# Altium schematic sheet Sheet1.SchDoc
size A4; SheetNumber: 1; SheetTotal: 5
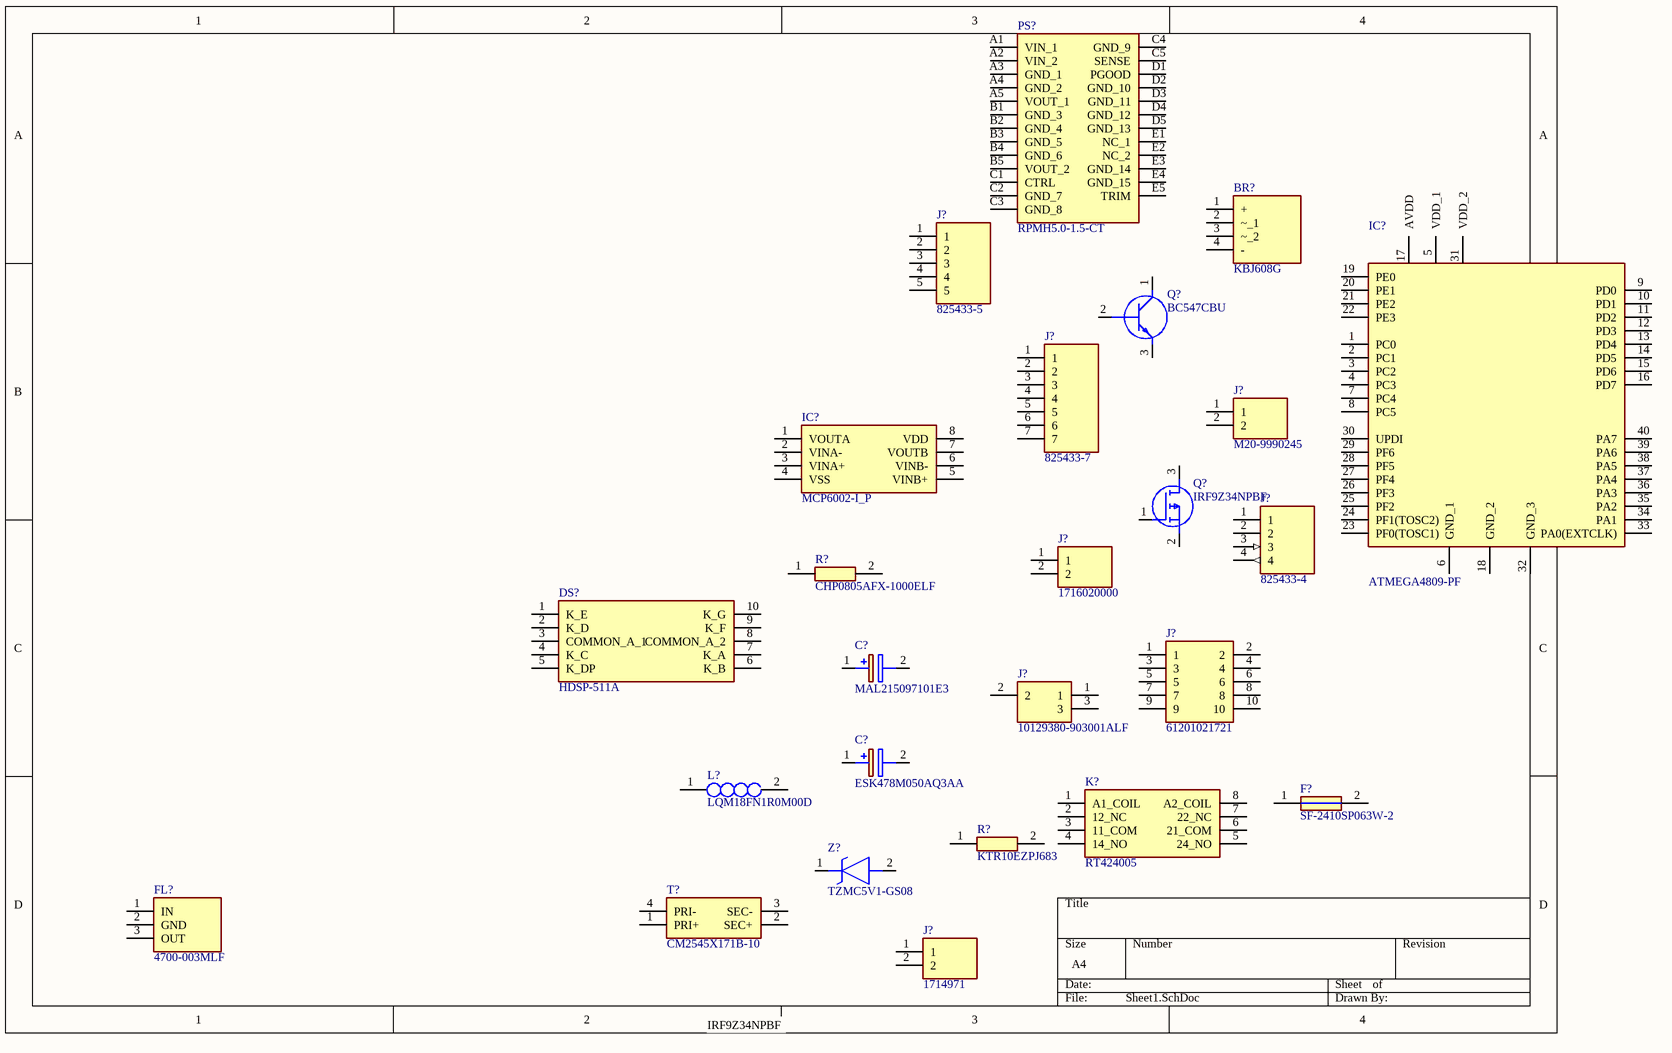
[diagram p0: Sheet1.SchDoc]

## Parts
(Parts that share a designator on the sheet are numbered #1, #2 ... from top to bottom, then left to right.)
BR?  KBJ608G  [TO750P480X2500X1900-4P]
C?#1  MAL215097101E3  [CAPAE1050X1050N]
C?#2  ESK478M050AQ3AA  [CAPPRD1000W80D2200H3700]
DS?  HDSP-511A  [HDSP511A]
F?  SF-2410SP063W-2  [FUSC6125X236N]
FL?  4700-003MLF  [4700003MLF]
IC?#1  ATMEGA4809-PF  [DIP1543W58P254L5175H635Q40N]
IC?#2  MCP6002-I_P  [DIP781W56P254L950H533Q8N]
J?#1  825433-5  [HDRV5W63P0X254_1X5_1270X254X970P]
J?#2  825433-7  [8254337]
J?#3  M20-9990245  [HDRV2W64P0X254_1X2_508X254X864P]
J?#4  825433-4  [HDRV4W63P0X254_1X4_1016X250X950P]
J?#5  1716020000  [1716020000]
J?#6  61201021721  [SHDRRA10W64P254X254_2X5_2036X885X910P]
J?#7  10129380-903001ALF  [10129380903001ALF]
J?#8  1714971  [1714971]
K?  RT424005  [RT42]
L?  LQM18FN1R0M00D  [LQM18FN100M00D]
PS?  RPMH5.0-1.5-CT  [RPMH5015]
Q?#1  BC547CBU  [BC547CBU]
Q?#2  IRF9Z34NPBF  [TO254P469X1042X1967-3P]
R?#1  CHP0805AFX-1000ELF  [RESC2012X60N]
R?#2  KTR10EZPJ683  [RESC2012X65N]
T?  CM2545X171B-10  [CM2545X171B10]
Z?  TZMC5V1-GS08  [TZMC5V1GS08]

## Nets

Not connected (* = marked no-connect by the designer): BR? 1(+) 2(~_1) 3(~_2) 4(-); C?#1 1(+) 2(-); C?#2 1(+) 2(-); DS? 1(K_E) 2(K_D) 3(COMMON_A_1) 4(K_C) 5(K_DP) 6(K_B) 7(K_A) 8(COMMON_A_2) 9(K_F) 10(K_G); F? 1 2; FL? 1(IN) 2(GND) 3(OUT); IC?#1 1(PC0) 2(PC1) 3(PC2) 4(PC3) 5(VDD_1) 6(GND_1) 7(PC4) 8(PC5) 9(PD0) 10(PD1) 11(PD2) 12(PD3) 13(PD4) 14(PD5) 15(PD6) 16(PD7) 17(AVDD) 18(GND_2) 19(PE0) 20(PE1) 21(PE2) 22(PE3) 23(PF0(TOSC1)) 24(PF1(TOSC2)) 25(PF2) 26(PF3) 27(PF4) 28(PF5) 29(PF6) 30(UPDI) 31(VDD_2) 32(GND_3) 33(PA0(EXTCLK)) 34(PA1) 35(PA2) 36(PA3) 37(PA4) 38(PA5) 39(PA6) 40(PA7); IC?#2 1(VOUTA) 2(VINA-) 3(VINA+) 4(VSS) 5(VINB+) 6(VINB-) 7(VOUTB) 8(VDD); J?#1 1 2 3 4 5; J?#2 1 2 3 4 5 6 7; J?#3 1 2; J?#4 1 2 3 4; J?#5 1 2; J?#6 1 2 3 4 5 6 7 8 9 10; J?#7 1 2 3; J?#8 1 2; K? 1(A1_COIL) 2(12_NC) 3(11_COM) 4(14_NO) 5(24_NO) 6(21_COM) 7(22_NC) 8(A2_COIL); L? 1 2; PS? A1(VIN_1) A2(VIN_2) A3(GND_1) A4(GND_2) A5(VOUT_1) B1(GND_3) B2(GND_4) B3(GND_5) B4(GND_6) B5(VOUT_2) C1(CTRL) C2(GND_7) C3(GND_8) C4(GND_9) C5(SENSE) D1(PGOOD) D2(GND_10) D3(GND_11) D4(GND_12) D5(GND_13) E1(NC_1) E2(NC_2) E3(GND_14) E4(GND_15) E5(TRIM); Q?#1 1(C) 2(B) 3(E); Q?#2 1(G) 2(S) 3(D); R?#1 1 2; R?#2 1 2; T? 1(PRI+) 2(SEC+) 3(SEC-) 4(PRI-); Z? 1(K) 2(A)

## Notes on the sheet
- IRF9Z34NPBF

## Library data of the parts
BR? = KBJ608G: Bridge Rectifier; Manufacturer_Name: Diodes Inc.; Datasheet Link: https://componentsearchengine.com//KBJ608G.pdf; Height: 4.8mm; Mouser2 Part Number: 621-KBJ608G; Mouser2 Price/Stock: https://www.mouser.com/Search/Refine.aspx?Keyword=621-KBJ608G; Manufacturer_Part_Number: KBJ608G
C?#1 = MAL215097101E3: Capacitor Polarised; Manufacturer_Name: Vishay; Datasheet Link: https://componentsearchengine.com/Datasheets/2/MAL215097101E3.pdf; Height: 10.5mm; Manufacturer_Part_Number: MAL215097101E3
C?#2 = ESK478M050AQ3AA: Capacitor Polarised; Manufacturer_Name: Kemet; Datasheet Link: https://componentsearchengine.com//ESK478M050AQ3AA.pdf; Height: 37mm; Mouser2 Part Number: 80-ESK478M050AQ3AA; Mouser2 Price/Stock: https://www.mouser.com/Search/Refine.aspx?Keyword=80-ESK478M050AQ3AA; Manufacturer_Part_Number: ESK478M050AQ3AA
DS? = HDSP-511A: Display; Manufacturer_Name: Avago Technologies; Datasheet Link: https://datasheet.datasheetarchive.com/originals/distributors/SFDatasheet-4/sf-00083626.pdf; Height: 8mm; Mouser2 Part Number: 630-HDSP-511A; Mouser2 Price/Stock: https://www.mouser.com/Search/Refine.aspx?Keyword=630-HDSP-511A; Manufacturer_Part_Number: HDSP-511A
F? = SF-2410SP063W-2: Fuse; Manufacturer_Name: Bourns; Datasheet Link: https://www.bourns.com/docs/Product-Datasheets/SF-2410SPxxxW.pdf; Height: 2.36mm; Manufacturer_Part_Number: SF-2410SP063W-2
FL? = 4700-003MLF: Filter; Manufacturer_Name: CTS; Datasheet Link: http://www.ctscorp.com/wp-content/uploads/2016/01/4700-003.pdf; Height: 2.41mm; Manufacturer_Part_Number: 4700-003MLF
IC?#1 = ATMEGA4809-PF: Integrated Circuit; Manufacturer_Name: Microchip; Datasheet Link: https://componentsearchengine.com//ATMEGA4809-PF.pdf; Height: 6.35mm; Mouser2 Part Number: 556-ATMEGA4809-PF; Mouser2 Price/Stock: https://www.mouser.com/Search/Refine.aspx?Keyword=556-ATMEGA4809-PF; Manufacturer_Part_Number: ATMEGA4809-PF
IC?#2 = MCP6002-I_P: Integrated Circuit; Manufacturer_Name: Microchip; Manufacturer_Part_Number: MCP6002-I/P; Datasheet Link: https://componentsearchengine.com//MCP6002-I_P.pdf; Height: 5.334mm; Mouser2 Part Number: 579-MCP6002-I/P; Mouser2 Price/Stock: https://www.mouser.com/Search/Refine.aspx?Keyword=579-MCP6002-I%2FP
J?#1 = 825433-5: Connector; Manufacturer_Name: TE Connectivity; Datasheet Link: https://componentsearchengine.com//825433-5.pdf; Height: 9.7mm; Mouser2 Part Number: 571-825433-5; Mouser2 Price/Stock: https://www.mouser.com/Search/Refine.aspx?Keyword=571-825433-5; Manufacturer_Part_Number: 825433-5
J?#2 = 825433-7: Connector; Manufacturer_Name: TE Connectivity; Datasheet Link: https://componentsearchengine.com//825433-7.pdf; Height: 9.9mm; Mouser2 Part Number: 571-825433-7; Mouser2 Price/Stock: https://www.mouser.com/Search/Refine.aspx?Keyword=571-825433-7; Manufacturer_Part_Number: 825433-7
J?#3 = M20-9990245: Connector; Manufacturer_Name: Harwin; Datasheet Link: https://componentsearchengine.com//M20-9990245.pdf; Height: 8.64mm; Mouser2 Part Number: 855-M20-9990245; Mouser2 Price/Stock: https://www.mouser.com/Search/Refine.aspx?Keyword=855-M20-9990245; Manufacturer_Part_Number: M20-9990245
J?#4 = 825433-4: Connector; Manufacturer_Name: TE Connectivity; Datasheet Link: https://componentsearchengine.com//825433-4.pdf; Height: 9.5mm; Mouser2 Part Number: 571-825433-4; Mouser2 Price/Stock: https://www.mouser.com/Search/Refine.aspx?Keyword=571-825433-4; Manufacturer_Part_Number: 825433-4
J?#5 = 1716020000: Connector; Manufacturer_Name: Weidmuller; Datasheet Link: https://catalog.weidmueller.com/catalog/Start.do?ObjectID=1716020000&_ga=2.21797499.1716783809.1613378202-511725545.1613378202; Manufacturer_Part_Number: 1716020000
J?#6 = 61201021721: Connector; Manufacturer_Name: Wurth Elektronik; Datasheet Link: https://componentsearchengine.com//61201021721.pdf; Height: 9.1mm; Mouser2 Part Number: 710-61201021721; Mouser2 Price/Stock: https://www.mouser.com/Search/Refine.aspx?Keyword=710-61201021721; Manufacturer_Part_Number: 61201021721
J?#7 = 10129380-903001ALF: Connector; Manufacturer_Name: Amphenol; Datasheet Link: https://cdn.amphenol-icc.com/media/wysiwyg/files/documentation/datasheet/boardwiretoboard/bwb_econostik_254headers.pdf; Height: 9.85mm; Manufacturer_Part_Number: 10129380-903001ALF
J?#8 = 1714971: Connector; Manufacturer_Name: Phoenix Contact; Datasheet Link: https://componentsearchengine.com/Datasheets/2/1714971.pdf; Height: 21.7mm; Manufacturer_Part_Number: 1714971
K? = RT424005: Relay or Contactor; Manufacturer_Name: TE Connectivity; Datasheet Link: https://componentsearchengine.com//RT424005.pdf; Mouser2 Part Number: 655-RT424005; Mouser2 Price/Stock: https://www.mouser.com/Search/Refine.aspx?Keyword=655-RT424005; Manufacturer_Part_Number: RT424005
L? = LQM18FN1R0M00D: Inductor; Manufacturer_Name: Murata Electronics; Datasheet Link: https://psearch.en.murata.com/inductor/product/LQM18FN1R0M00%23.html; Height: 0.9mm; Manufacturer_Part_Number: LQM18FN1R0M00D
PS? = RPMH5.0-1.5-CT: Power Supply; Manufacturer_Name: RECOM Power; Datasheet Link: https://recom-power.com/pdf/Innoline/RPMH-1.5.pdf; Height: 4mm; Manufacturer_Part_Number: RPMH5.0-1.5-CT
Q?#1 = BC547CBU: Transistor BJT NPN; Manufacturer_Name: ON Semiconductor; Datasheet Link: https://www.onsemi.com/pdf/datasheet/bc550-d.pdf; Height: 5.33mm; Manufacturer_Part_Number: BC547CBU
Q?#2 = IRF9Z34NPBF: MOSFET (P-Channel); Manufacturer_Name: Infineon; Datasheet Link: https://componentsearchengine.com//IRF9Z34NPBF.pdf; Height: 4.69mm; Mouser2 Part Number: 942-IRF9Z34NPBF; Mouser2 Price/Stock: https://www.mouser.com/Search/Refine.aspx?Keyword=942-IRF9Z34NPBF; Manufacturer_Part_Number: IRF9Z34NPBF
R?#1 = CHP0805AFX-1000ELF: Resistor; Manufacturer_Name: Bourns; Datasheet Link: https://www.mouser.cn/datasheet/2/54/chp-a-1858677.pdf; Height: 0.6mm; Manufacturer_Part_Number: CHP0805AFX-1000ELF
R?#2 = KTR10EZPJ683: Resistor; Manufacturer_Name: ROHM Semiconductor; Datasheet Link: https://datasheet.datasheetarchive.com/originals/distributors/DKDS-18/356469.pdf; Height: 0.65mm; Manufacturer_Part_Number: KTR10EZPJ683
T? = CM2545X171B-10: Transformer; Manufacturer_Name: Laird Technologies; Datasheet Link: https://datasheet.datasheetarchive.com/originals/dk/DKDS-7/122753.pdf; Height: 9.5mm; Manufacturer_Part_Number: CM2545X171B-10
Z? = TZMC5V1-GS08: Zener Diode; Manufacturer_Name: Vishay; Datasheet Link: https://componentsearchengine.com/Datasheets/2/TZMC5V1-GS08.pdf; Height: 1.6mm; Manufacturer_Part_Number: TZMC5V1-GS08